# EAGLE design Adafruit 3.5in 480x320 FeatherWing (EAGLE 6.6.0)
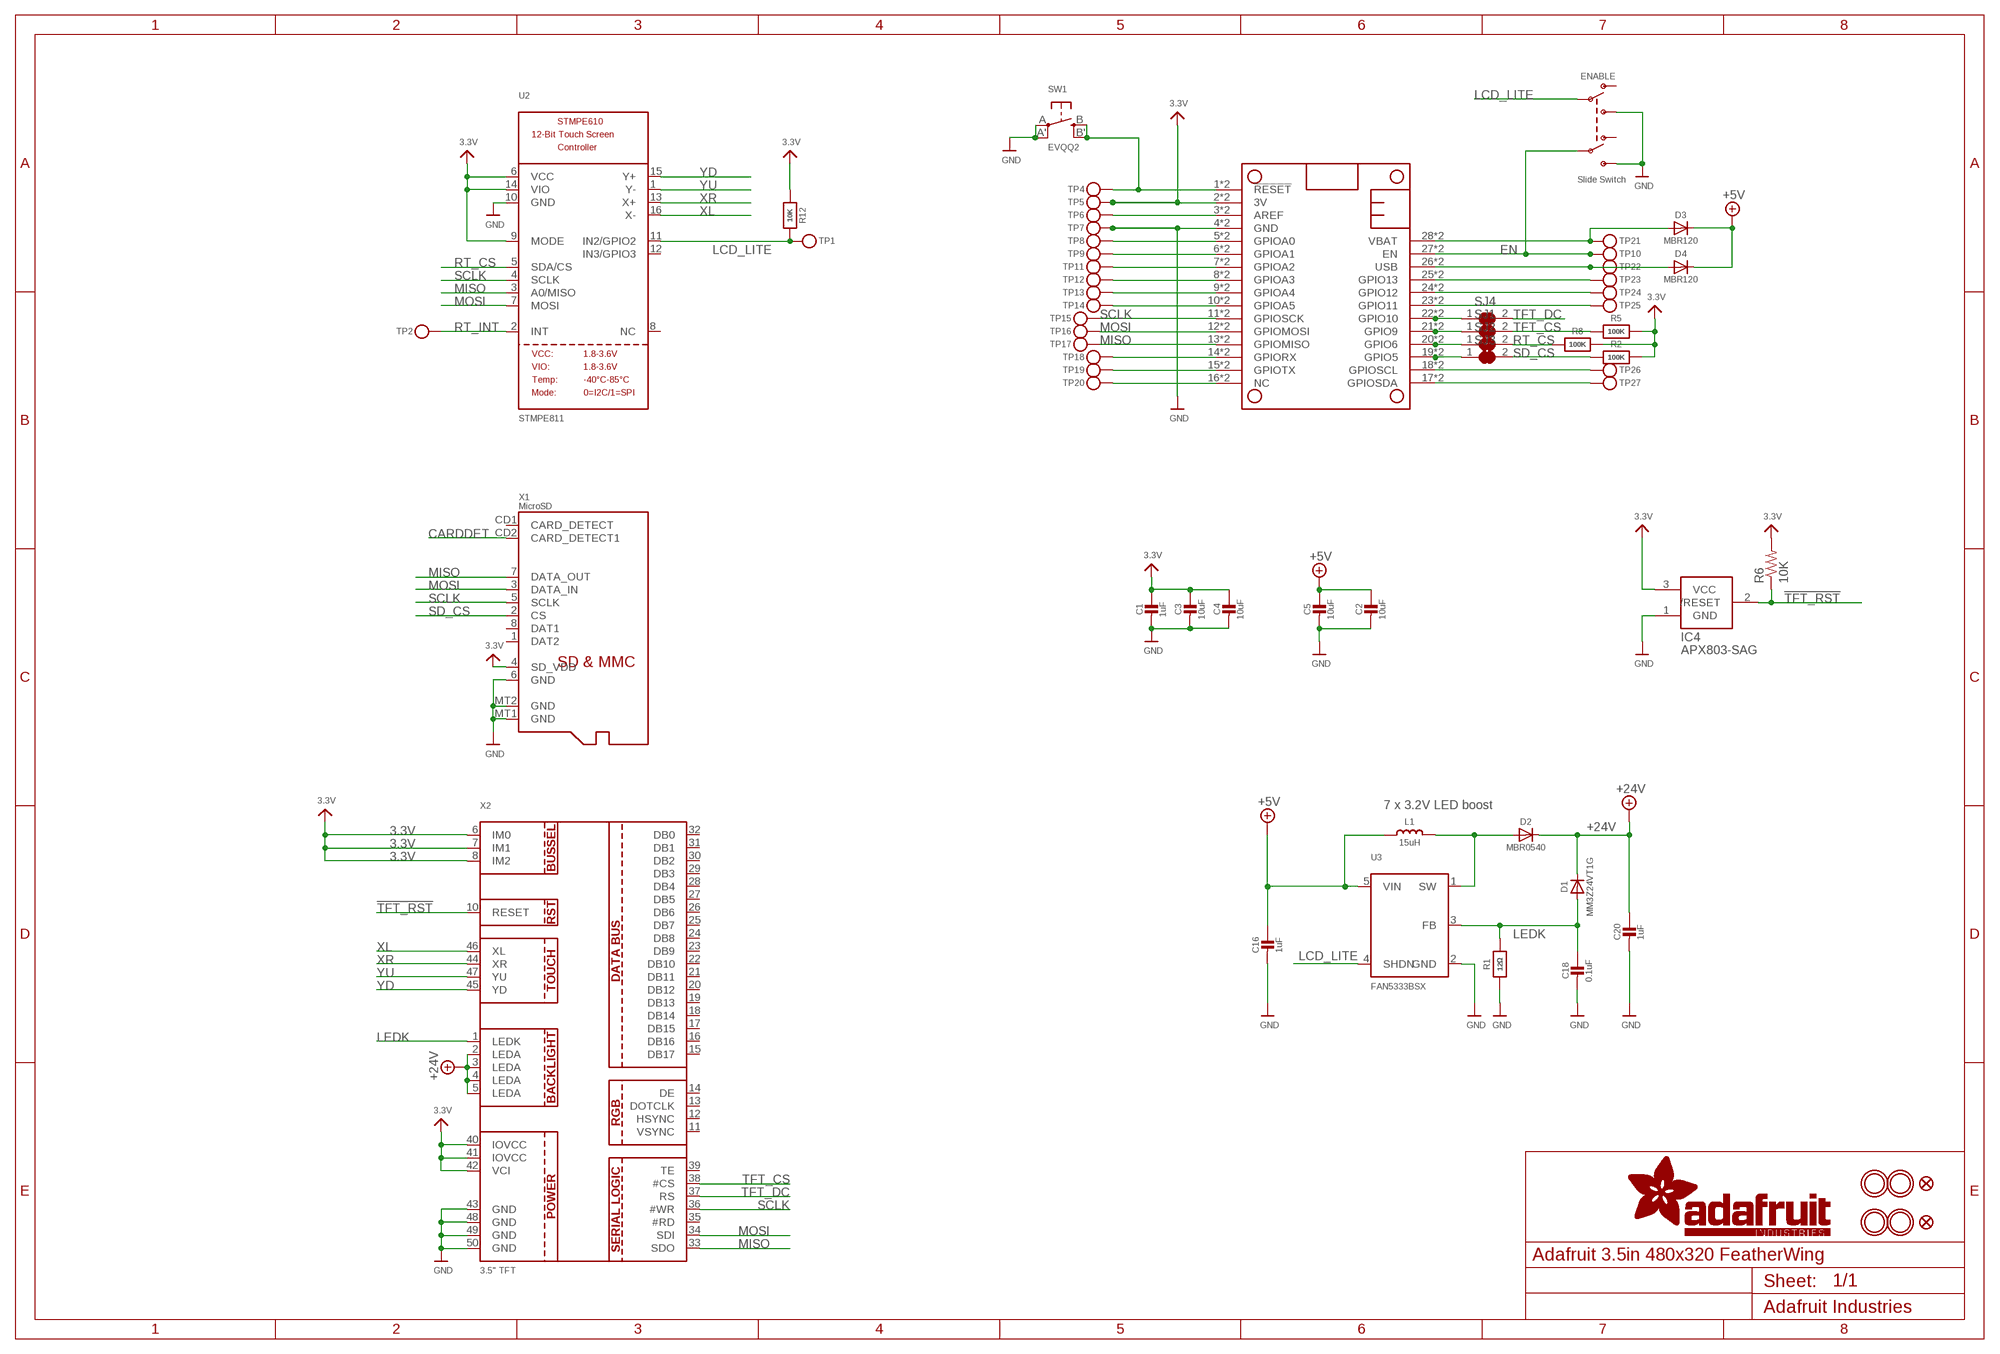
[diagram p0: schematic, sheet 1]

## Parts
C1  1uF  CAP_CERAMIC0805-NOOUTLINE  [0805-NO]
C2  10uF  CAP_CERAMIC0805-NOOUTLINE  [0805-NO]
C3  10uF  CAP_CERAMIC0805-NOOUTLINE  [0805-NO]
C4  10uF  CAP_CERAMIC0805-NOOUTLINE  [0805-NO]
C5  10uF  CAP_CERAMIC0805-NOOUTLINE  [0805-NO]
C16  1uF  CAP_CERAMIC0805-NOOUTLINE  [0805-NO]
C18  0.1uF  CAP_CERAMIC0805-NOOUTLINE  [0805-NO]
C20  1uF  CAP_CERAMIC0805-NOOUTLINE  [0805-NO]
D1  MM3Z24VT1G  DIODESMA  [SMADIODE]
D2  MBR0540  DIODESOD-123  [SOD-123]
D3  MBR120  DIODESOD-123  [SOD-123]
D4  MBR120  DIODESOD-123  [SOD-123]
ENABLE  Slide Switch  SWITCH_DPDTEG1390  [EG1390]
IC4  APX803-SAG  AXP083-SAG  [SOT23]
L1  15uH  INDUCTORNR5040  [INDUCTOR_5X5MM_NR5040_NOTHERMALS]
MS2  FEATHERWING_SMTDUAL  [FEATHERWING_SMT2]
R1  12Ω  RESISTOR0805_NOOUTLINE  [0805-NO]
R2  100K  RESISTOR0805_NOOUTLINE  [0805-NO]
R5  100K  RESISTOR0805_NOOUTLINE  [0805-NO]
R6  10K  R-US_R0805  [R0805]
R8  100K  RESISTOR0805_NOOUTLINE  [0805-NO]
R12  10K  RESISTOR0805_NOOUTLINE  [0805-NO]
SJ1  SOLDERJUMPER_CLOSED  [SOLDERJUMPER_CLOSEDWIRE]
SJ2  SOLDERJUMPER_CLOSED  [SOLDERJUMPER_CLOSEDWIRE]
SJ3  SOLDERJUMPER_CLOSED  [SOLDERJUMPER_CLOSEDWIRE]
SJ4  SOLDERJUMPER_CLOSED  [SOLDERJUMPER_CLOSEDWIRE]
SW1  EVQQ2  SWITCH_TACT_SMT_EVQQ2_SMALL  [EVQ-Q2_SMALLER]
TP1  TESTPOINTPAD2MM  [TESTPOINT_PAD_2MM]
TP2  TESTPOINTPAD2MM  [TESTPOINT_PAD_2MM]
TP4  TESTPOINTPAD2MM  [TESTPOINT_PAD_2MM]
TP5  TESTPOINTPAD2MM  [TESTPOINT_PAD_2MM]
TP6  TESTPOINTPAD2MM  [TESTPOINT_PAD_2MM]
TP7  TESTPOINTPAD2MM  [TESTPOINT_PAD_2MM]
TP8  TESTPOINTPAD2MM  [TESTPOINT_PAD_2MM]
TP9  TESTPOINTPAD2MM  [TESTPOINT_PAD_2MM]
TP10  TESTPOINTPAD2MM  [TESTPOINT_PAD_2MM]
TP11  TESTPOINTPAD2MM  [TESTPOINT_PAD_2MM]
TP12  TESTPOINTPAD2MM  [TESTPOINT_PAD_2MM]
TP13  TESTPOINTPAD2MM  [TESTPOINT_PAD_2MM]
TP14  TESTPOINTPAD2MM  [TESTPOINT_PAD_2MM]
TP15  TESTPOINTPAD2MM  [TESTPOINT_PAD_2MM]
TP16  TESTPOINTPAD2MM  [TESTPOINT_PAD_2MM]
TP17  TESTPOINTPAD2MM  [TESTPOINT_PAD_2MM]
TP18  TESTPOINTPAD2MM  [TESTPOINT_PAD_2MM]
TP19  TESTPOINTPAD2MM  [TESTPOINT_PAD_2MM]
TP20  TESTPOINTPAD2MM  [TESTPOINT_PAD_2MM]
TP21  TESTPOINTPAD2MM  [TESTPOINT_PAD_2MM]
TP22  TESTPOINTPAD2MM  [TESTPOINT_PAD_2MM]
TP23  TESTPOINTPAD2MM  [TESTPOINT_PAD_2MM]
TP24  TESTPOINTPAD2MM  [TESTPOINT_PAD_2MM]
TP25  TESTPOINTPAD2MM  [TESTPOINT_PAD_2MM]
TP26  TESTPOINTPAD2MM  [TESTPOINT_PAD_2MM]
TP27  TESTPOINTPAD2MM  [TESTPOINT_PAD_2MM]
U2  STMPE811  STMPE610  [QFN16_3MM]
U3  FAN5333BSX  FAN5331  [SOT23-5@1]
U$7  MOUNTINGHOLE3.0THIN  [MOUNTINGHOLE_3.0_PLATEDTHIN]
U$9  FIDUCIAL_1MM  [FIDUCIAL_1MM]
U$15  MOUNTINGHOLE3.0THIN  [MOUNTINGHOLE_3.0_PLATEDTHIN]
U$16  MOUNTINGHOLE3.0THIN  [MOUNTINGHOLE_3.0_PLATEDTHIN]
U$17  MOUNTINGHOLE3.0THIN  [MOUNTINGHOLE_3.0_PLATEDTHIN]
U$23  FIDUCIAL_1MM  [FIDUCIAL_1MM]
X1  MicroSD  MICROSD  [MICROSD]
X2  3.5" TFT  DISP_LCD_3.5IN_320X480_50PIN  [TFT_3.5IN_320X480_50PIN]

## Nets
3.3V: C1.1 C3.1 C4.1 IC4.3(VCC) MS2.2'(3V) MS2.2(3V) R2.2 R5.2 R6.2 R8.2 R12.1 TP5.P$1 U2.6(VCC) U2.9(MODE) U2.14(VIO) X1.4(SD_VDD) X2.6(IM0) X2.7(IM1) X2.8(IM2) X2.40(IOVCC) X2.41(IOVCC) X2.42(VCI)
!RESET: MS2.1'(!RESET) MS2.1(!RESET) SW1.B'(S1) SW1.B(S) TP4.P$1
!TFT_RST: IC4.2(/RESET) R6.1 X2.10(RESET)
+5V: C2.1 C5.1 C16.1 D3.C D4.C L1.P$1 U3.5(VIN)
+24V: C20.1 D1.C D2.C X2.2(LEDA) X2.3(LEDA) X2.4(LEDA) X2.5(LEDA)
A: MS2.5'(GPIOA0) MS2.5(GPIOA0) TP8.P$1
AREF: MS2.3'(AREF) MS2.3(AREF) TP6.P$1
B: MS2.6'(GPIOA1) MS2.6(GPIOA1) TP9.P$1
C: MS2.7'(GPIOA2) MS2.7(GPIOA2) TP11.P$1
CARDDET: X1.CD2(CARD_DETECT1)
D: MS2.8'(GPIOA3) MS2.8(GPIOA3) TP12.P$1
E: MS2.9'(GPIOA4) MS2.9(GPIOA4) TP13.P$1
EN: ENABLE.P2 MS2.27'(EN) MS2.27(EN) TP10.P$1
F: MS2.10'(GPIOA5) MS2.10(GPIOA5) TP14.P$1
G: MS2.16'(NC) MS2.16(NC) TP20.P$1
GND: C1.2 C2.2 C3.2 C4.2 C5.2 C16.2 C18.2 C20.2 ENABLE.S1 ENABLE.S2 IC4.1(GND) MS2.4'(GND) MS2.4(GND) R1.1 SW1.A'(P1) SW1.A(P) TP7.P$1 U2.10(GND) U3.2(GND) X1.6(GND) X1.MT1(GND) X1.MT2(GND) X2.43(GND) X2.48(GND) X2.49(GND) X2.50(GND)
H: MS2.19'(GPIO5) MS2.19(GPIO5) SJ3.1
I: MS2.20'(GPIO6) MS2.20(GPIO6) SJ2.1
J: MS2.21'(GPIO9) MS2.21(GPIO9) SJ1.1
K: MS2.22'(GPIO10) MS2.22(GPIO10) SJ4.1
L: MS2.23'(GPIO11) MS2.23(GPIO11) TP25.P$1
LCD_LITE: ENABLE.P1 R12.2 TP1.P$1 U2.11(IN2/GPIO2) U3.4(SHDN)
LEDK: C18.1 D1.A R1.2 U3.3(FB) X2.1(LEDK)
M: MS2.24'(GPIO12) MS2.24(GPIO12) TP24.P$1
MISO: MS2.13'(GPIOMISO) MS2.13(GPIOMISO) TP17.P$1 U2.3(A0/MISO) X1.7(DATA_OUT) X2.33(SDO)
MOSI: MS2.12'(GPIOMOSI) MS2.12(GPIOMOSI) TP16.P$1 U2.7(MOSI) X1.3(DATA_IN) X2.34(SDI)
N: MS2.25'(GPIO13) MS2.25(GPIO13) TP23.P$1
N$3: D2.A L1.P$2 U3.1(SW)
RT_CS: R8.1 SJ2.2 U2.5(SDA/CS)
RT_INT: TP2.P$1 U2.2(INT)
RX: MS2.14'(GPIORX) MS2.14(GPIORX) TP18.P$1
SCL: MS2.18'(GPIOSCL) MS2.18(GPIOSCL) TP26.P$1
SCLK: MS2.11'(GPIOSCK) MS2.11(GPIOSCK) TP15.P$1 U2.4(SCLK) X1.5(SCLK) X2.36(#WR)
SD_CS: R2.1 SJ3.2 X1.2(CS)
SDA: MS2.17'(GPIOSDA) MS2.17(GPIOSDA) TP27.P$1
TFT_CS: R5.1 SJ1.2 X2.38(#CS)
TFT_DC: SJ4.2 X2.37(RS)
TX: MS2.15'(GPIOTX) MS2.15(GPIOTX) TP19.P$1
USB: D4.A MS2.26'(USB) MS2.26(USB) TP22.P$1
VBAT: D3.A MS2.28'(VBAT) MS2.28(VBAT) TP21.P$1
XL: U2.16(X-) X2.46(XL)
XR: U2.13(X+) X2.44(XR)
YD: U2.15(Y+) X2.45(YD)
YU: U2.1(Y-) X2.47(YU)
Unconnected: ENABLE.O1 ENABLE.O2 U2.8(NC) U2.12(IN3/GPIO3) X1.1(DAT2) X1.8(DAT1) X1.CD1(CARD_DETECT) X2.11(VSYNC) X2.12(HSYNC) X2.13(DOTCLK) X2.14(DE) X2.15(DB17) X2.16(DB16) X2.17(DB15) X2.18(DB14) X2.19(DB13) X2.20(DB12) X2.21(DB11) X2.22(DB10) X2.23(DB9) X2.24(DB8) X2.25(DB7) X2.26(DB6) X2.27(DB5) X2.28(DB4) X2.29(DB3) X2.30(DB2) X2.31(DB1) X2.32(DB0) X2.35(#RD) X2.39(TE)

## Notes on the sheet
- 7 x 3.2V LED boost

## Library data of the parts
C1-C5 C16 C18 C20 = microbuilder:CAP_CERAMIC: Ceramic Capacitors For new designs, use the packages preceded by an '_' character since they are more reliable: The following footprints should be used on most boards: _0402 - Standard footprint for regular board layouts _0603 - Standard footprint for regular board layouts _0805 - Standard footprint for regular board layouts _1206 - Standard footprint for regular board layouts For extremely tight-pitch boards where space is at a premium, the following 'micro-pitch' footprints can be used (smaller pads, no silkscreen outline, etc.): _0402MP - Micro-pitch footprint for very dense/compact boards _0603MP - Micro-pitch footprint for very dense/compact boards _0805MP - Micro-pitch footprint for very dense/compact boards _1206MP - Micro-pitch footprint for very dense/compact boards
D1-D4 = microbuilder:DIODE: Diode SMA Model Volts Amps Type Vf Ir Digikey # Notes SSA34-E3 40V 3A Schottky 480mV @ 3A 200uA @ 40V SSA34-E3/61TGITR-ND CDBA120-G 20V 1A Schottky 500mV @ 1A 500uA @ 20V 641-1014-6-ND REEL MBRA210 10V 2A Schottky 350mV @ 2A 700uA @ 10V MBRA210LT3 SOD-123 Model Volts Amps Type Vf Ir Order # Notes BAT54T1G 30V 200mA Schottky 800mV @ 200mA 2uA @ 25V BAT54T1GOSTR-ND B0530W 30V 500mA Schottky 430mV @ 500mA 130uA @ 30V B0530W-FDICT-ND REEL MBR120 20V 1A Schottky 340mV @ 1A MBR120VLSFT1GOSCT-ND SOD-323 Model Volts Amps Type Vf Ir Order # Notes PMEG2005EJ 20V 500mA Schottky 355mV @ 500mA 568-4110-1-ND ZLLS410 10V 570mA Schottky 380mV @ 570mA ZLLS410CT-ND 1N4148WS 75V 150mA Silicon/Simple 1V 1N4148WSFSCT-ND REEL SOD-523 Model Volts Amps Type Vf Ir Order # Notes BAT54XV2 30V 200mA Schottky 0.8V @ 100mA BAT54XV2CT-ND TB751S 30V 30mA Schottky RB751S-40TE61CT-ND SOT23-R/W (R = Solder Paste/Reflow Ovens, W = Hand-Soldering) Model Volts Amps Type Vf Ir Order # Notes BAT54FILM 40V 300mA Schottky 497-7162-1-ND POWERDI-5 Model Volts Amps Type Vf Ir Order # Notes PDS560 60V 5A Schottky 670mV @ 5A 150uA @ 60V PDS560DICT-ND
ENABLE = microbuilder:SWITCH_DPDT: Switch - DPDT A DPDT Switch acts like an SPDT switch, but has a pair of switches instead of just one. Vertical - 0.3A @ 6V SMT - Digikey: JS202011SCQN
IC4 = adafruit:AXP083
L1 = microbuilder:INDUCTOR: Inductors 0603: 10nH Ceramic Inductor - microwire antenna/RF (Digikey: 712-1434-2-ND) 0805: 560nH Ceramic Inductor - RF (Digikey: 553-1047-1-ND) 270nH Ceramic Inductor - Q = 40@250MHz, +-5%, 1 Ohm DC Resistance (Digikey: 535-10506-2-ND) 1007 (2518 Metric) SMT: 10µH 10% 250mOhm 820mA 1007 Inductor (Digikey: 587-2189-1-ND) 22µH 10% 500mOhm 580mA 1007 Inductor (Digikey: 587-2190-1-ND) 47µH 10% 950mOhm 420mA 1007 Inductor (Digikey: 587-2191-1-ND) 47µH 5% 100mOhm 1A 1008 Inductor (Digikey: 732-1816-1-ND) 5.0x5.0mm (Taiyo Yuden NR5040 Series) 6.8µH 20% 2.3A 64mOhm Inductor (Digikey: 587-2374-2-ND) 5.0x5.0mm (TDK VLC5045 Series) 4.7µH 20% 3.3A 34mOhm Inductor (Digikey: 445-6526-1-ND) 6.8µH 20% 2.7A 46mOhm Inductor (Digikey: 445-6527-1-ND) 6.0x6.0mm (TDK VLC6045 Series) 4.7µH 20% 3.8A 27mOhm Inductor (Digikey: 445-6538-2-ND) 6.8µH 20% 3A 41mOhm Inductor (Digikey: 445-6540-1-ND) 6.2µH 30% 2.2A 45mOhm Inductor (Digikey: SRR5028-6R2YCT-ND) - Not TDK VLC6045 but footprint should match 6.0x6.0mm (TDK SLF6045 Series) 6.8uH 30% 2A 33mOhm Inductor (Digikey: 445-4572-1-ND, Mouser: 810-SLF645T6R8N2R0PF) 6.0x6.0mm (Sumida CDRH5D28 Series) 6.2uH 30% 1.8A 45mOhm Inductor (Digikey: 308-1542-1-ND) Taiyo Yuden NR3015T2R2M - 2.2uH 20% 1.5A (Digikey: 587-1648-2-ND, Mouser: 963-NR3015T2R2M) - Used with TI TPS62172 CoilCraft RFID Transponder Coil - MA5532-AE (For use with AS3935 Lightning Sensor) Taiyo Yuden NRH2412T2R2MNGH - 2.2uH 20% 1AA (Digikey: 587-3443-1-ND) - Used with TI LM3671 Vishay IHLP 1.0uH Molded Inductor - 24mOhm DCR, 5A, +/-20%, -55°C-125°C (Digikey: 541-1319-1-ND)
MS2 = microbuilder:FEATHERWING
R1 R2 R5 R8 R12 = microbuilder:RESISTOR: Resistors For new designs, use the packages preceded by an '_' character since they are more reliable: The following footprints should be used on most boards: _0402 - Standard footprint for regular board layouts _0603 - Standard footprint for regular board layouts _0805 - Standard footprint for regular board layouts _1206 - Standard footprint for regular board layouts For extremely tight-pitch boards where space is at a premium, the following 'micro-pitch' footprints can be used (smaller pads, no silkscreen outline, etc.): _0402MP - Micro-pitch footprint for very dense/compact boards _0603MP - Micro-pitch footprint for very dense/compact boards _0805MP - Micro-pitch footprint for very dense/compact boards _1206MP - Micro-pitch footprint for very dense/compact boards
R6 = rcl:R-US_: RESISTOR, American symbol
SJ1-SJ4 = microbuilder:SOLDERJUMPER_CLOSED: Solder Jumper - Closed These solder jumpers are closed by default CLOSEDWIRE - 10 mil trace between pads that can be cut and resoldered later CLOSEDPERM - 63 mil trace between pads for a permanent connection (used to 'bridge' two signals, a shameless hack for Eagle). Can double as a test point as well (no cream layer)
SW1 = microbuilder:SWITCH_TACT_SMT: SMT Tact Switches 6x6mm - Digikey: P12940SCT-ND KMR2 (4.6x2.8mm) - Digikey: 401-1426-1-ND EVQ-PQHB55 - Light Touch, 160GF (4.5x4.5mm) - Digikey: P8090SCT-ND KMT0 - KMT021 NGJ LHS (etc.) IP68/Waterproof - Digikey: CKN10289CT-ND
TP1 TP2 TP4-TP27 = microbuilder:TESTPOINT: Test Point Various test points for characterisation and PCB testing TESTPOINT_SMT - Compact Surface Mount Test Point [Digikey: 5016KTR-ND]
U2 = microbuilder:STMPE610: STMPE610 - 12-Bit Touch Screen Controller
U3 = microbuilder:FAN5331: FAN5331 - LED/OLED 20V Boost Converter Digikey: FAN5331SXCT-ND
U$7 U$15-U$17 = microbuilder:MOUNTINGHOLE: Mounting Hole For #2 screws (0.086"/2.18mm width, 0.094"/2.4mm hole) use 2.5mm; BOM: EXCLUDE
U$9 U$23 = microbuilder:FIDUCIAL: Fiducial Alignment Points Various fiducial points for machine vision alignment.; BOM: EXCLUDE
X1 = microbuilder:MICROSD: MicroSD/Transflash Card Holder with SPI pinout 3M: 2908-05WB-MG 4UConnector: 19656 Footprint courtesy: Adafruit Industries
X2 = microbuilder:DISP_LCD_3.5IN_320X480_50PIN: DT350HV15-T - 3.5" 320x480 TFT Display, 50 Pin Connector

## Board
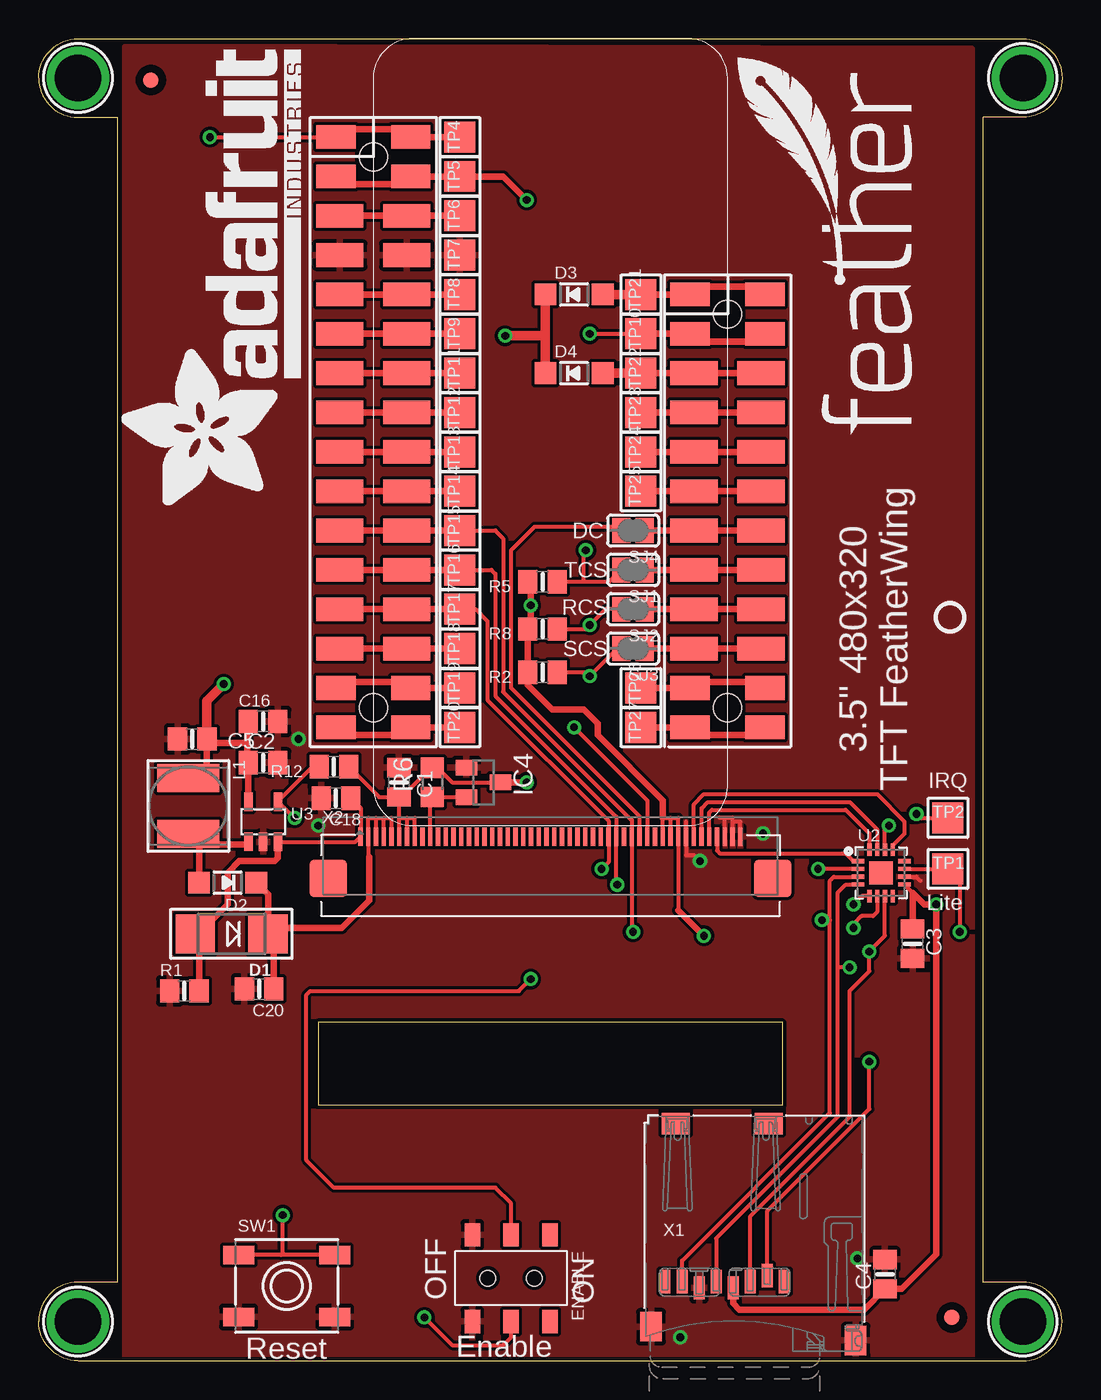
[diagram p1: board, top side]
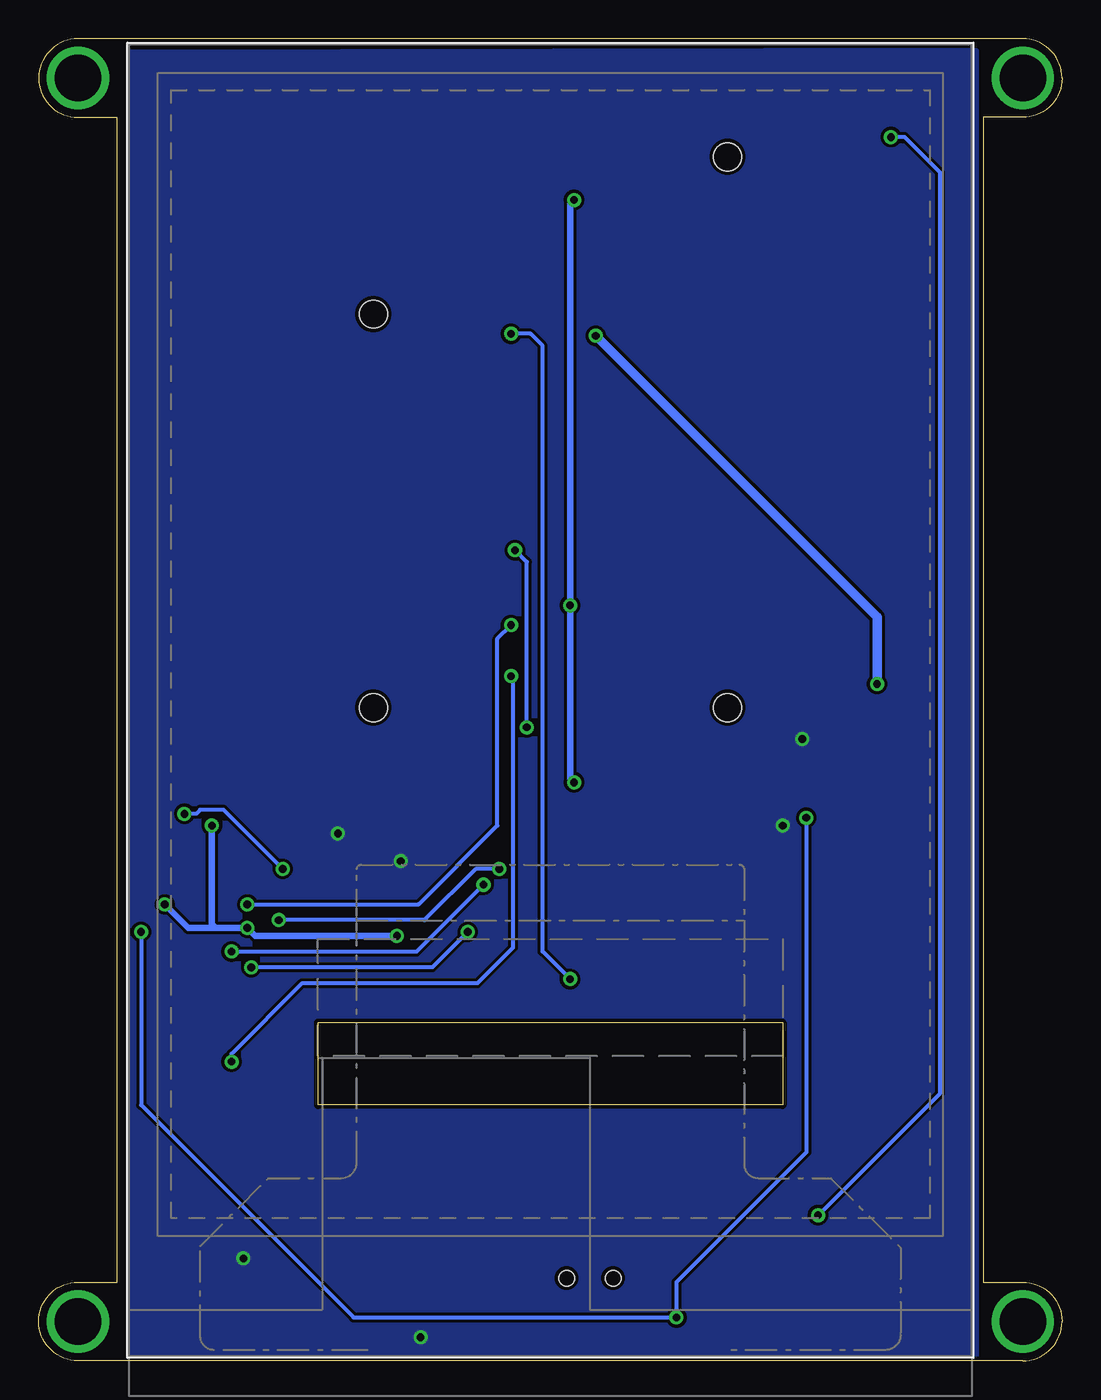
[diagram p2: board, bottom side, seen from below]

Size 66.04 x 85.34 mm. Coordinates in mm from the lower left corner, seen from the top.
Outline: 2.54,0 63.5,0 arc90 66.04,2.54 arc90 63.5,5.08 60.96,5.08 60.96,80.26 63.5,80.26 arc90 66.04,82.8 arc90 63.5,85.34 2.54,85.34 arc90 0,82.8 arc90 2.54,80.26 5.08,80.26 5.08,5.08 2.54,5.08 arc90 0,2.54 arc90 2.54,0
Outline: 18.03,21.84 18.03,16.51 48.01,16.51 48.01,21.84 18.03,21.84
Copper layers (1*16): Top 0.035mm / dielectric 1.5mm / Bottom 0.035mm
Design rules "adafruit *": minimum track width 8mil, minimum drill 15.5mil, track to track 8mil, track to pad 8mil, pad to pad 8mil, via to via 8mil, smd to smd 8mil, copper to edge 10mil, drill to drill 8mil, minimum pad ring 10mil, minimum via ring 8mil, stop-mask expansion 2mil, vias tented up to drill 20mil, thermal gap 10mil
tRestrict: area 44.5,33.7 to 44.6,34; area 45,33.7 to 45.1,34

### Footprints (pad centres in the part's own frame; a part is rotated, then mirrored left to right if it is on the bottom)
0805-NO = smd 1.24 x 1.5: 1 -0.95,0; 2 0.95,0
SMADIODE = smd 2.54 x 2.54: A 2.349,0; C -2.349,0
SOD-123 = smd 1.4 x 1.4: A 1.85,0; C -1.85,0
EG1390 = smd 1 x 1.5: O1 -2.5,2.8; O2 -2.5,-2.8; P1 0,2.8; P2 0,-2.8; S1 2.5,2.8; S2 2.5,-2.8 | hole 1: 1.5,0; -1.5,0
SOT23 = smd 1 x 1.4: 1 -0.95,-1.1; 2 0.95,-1.1; 3 0,1.1
INDUCTOR_5X5MM_NR5040_NOTHERMALS = smd 1.8 x 4: P$1 -1.8,0; P$2 1.8,0
FEATHERWING_SMT2 = smd 1.524 x 2.54: 1 6.35,2.413; 1' 6.35,-2.413; 2 8.89,2.413; 2' 8.89,-2.413; 15 41.91,2.413; 15' 41.91,-2.413; 16 44.45,2.413; 16' 44.45,-2.413; 17 44.45,20.447; 17' 44.45,25.273; 18 41.91,20.447; 18' 41.91,25.273; 27 19.05,20.447; 27' 19.05,25.273; 28 16.51,20.447; 28' 16.51,25.273 | smd 1.524 x 3.048: 3 11.43,2.159; 3' 11.43,-2.159; 4 13.97,2.159; 4' 13.97,-2.159; 5 16.51,2.159; 5' 16.51,-2.159; 6 19.05,2.159; 6' 19.05,-2.159; 7 21.59,2.159; 7' 21.59,-2.159; 8 24.13,2.159; 8' 24.13,-2.159; 9 26.67,2.159; 9' 26.67,-2.159; 10 29.21,2.159; 10' 29.21,-2.159; 11 31.75,2.159; 11' 31.75,-2.159; 12 34.29,2.159; 12' 34.29,-2.159; 13 36.83,2.159; 13' 36.83,-2.159; 14 39.37,2.159; 14' 39.37,-2.159; 19 39.37,20.701; 19' 39.37,25.019; 20 36.83,20.701; 20' 36.83,25.019; 21 34.29,20.701; 21' 34.29,25.019; 22 31.75,20.701; 22' 31.75,25.019; 23 29.21,20.701; 23' 29.21,25.019; 24 26.67,20.701; 24' 26.67,25.019; 25 24.13,20.701; 25' 24.13,25.019; 26 21.59,20.701; 26' 21.59,25.019 | hole 1.8: 17.78,22.86; 43.18,22.86; 7.62,0; 43.18,0
R0805 = smd 1.3 x 1.5: 1 -0.95,0; 2 0.95,0
SOLDERJUMPER_CLOSEDWIRE = smd 1.168 x 1.6: 1 -0.762,0; 2 0.762,0 | smd 0.635 x 0.203: WIRE 0,0
EVQ-Q2_SMALLER = smd 2 x 1.2: A -3.1,-2; A' 3.1,-2; B -3.1,2; B' 3.1,2
TESTPOINT_PAD_2MM = smd 2 x 2: P$1 0,0
QFN16_3MM = smd 0.8 x 0.28: 1 -1.5,0.75; 2 -1.5,0.25; 3 -1.5,-0.25; 4 -1.5,-0.75; 9 1.5,-0.75; 10 1.5,-0.25; 11 1.5,0.25; 12 1.5,0.75 | smd 0.28 x 0.8: 5 -0.75,-1.5; 6 -0.25,-1.5; 7 0.25,-1.5; 8 0.75,-1.5; 13 0.75,1.5; 14 0.25,1.5; 15 -0.25,1.5; 16 -0.75,1.5 | smd 1.5 x 1.5: THERMAL 0,0
SOT23-5@1 = smd 0.55 x 1.2: 1 -0.95,-1.3; 2 0,-1.3; 3 0.95,-1.3; 4 0.95,1.3; 5 -0.95,1.3
MOUNTINGHOLE_3.0_PLATEDTHIN = drill 3 pad 3.6: P$1 0,0
FIDUCIAL_1MM = smd 1 x 1: 1 0,0
MICROSD = smd 0.7 x 1.5: 1 9,-10.64; 2 7.9,-10.24; 3 6.8,-10.64; 4 5.7,-11.04; 5 4.6,-10.64; 6 3.5,-11.04; 7 2.4,-10.64; 8 1.3,-10.64 | smd 1.8 x 1.4: CD1 2,-0.44; CD2 8,-0.44 | smd 1.4 x 1.9: MT1 0.4,-13.54; MT2 13.6,-14.44
TFT_3.5IN_320X480_50PIN = smd 0.275 x 1.2 bottom: 1 12.25,-3.76; 2 11.75,-3.76; 3 11.25,-3.76; 4 10.75,-3.76; 5 10.25,-3.76; 6 9.75,-3.76; 7 9.25,-3.76; 8 8.75,-3.76; 9 8.25,-3.76; 10 7.75,-3.76; 11 7.25,-3.76; 12 6.75,-3.76; 13 6.25,-3.76; 14 5.75,-3.76; 15 5.25,-3.76; 16 4.75,-3.76; 17 4.25,-3.76; 18 3.75,-3.76; 19 3.25,-3.76; 20 2.75,-3.76; 21 2.25,-3.76; 22 1.75,-3.76; 23 1.25,-3.76; 24 0.75,-3.76; 25 0.25,-3.76; 26 -0.25,-3.76; 27 -0.75,-3.76; 28 -1.25,-3.76; 29 -1.75,-3.76; 30 -2.25,-3.76; 31 -2.75,-3.76; 32 -3.25,-3.76; 33 -3.75,-3.76; 34 -4.25,-3.76; 35 -4.75,-3.76; 36 -5.25,-3.76; 37 -5.75,-3.76; 38 -6.25,-3.76; 39 -6.75,-3.76; 40 -7.25,-3.76; 41 -7.75,-3.76; 42 -8.25,-3.76; 43 -8.75,-3.76; 44 -9.25,-3.76; 45 -9.75,-3.76; 46 -10.25,-3.76; 47 -10.75,-3.76; 48 -11.25,-3.76; 49 -11.75,-3.76; 50 -12.25,-3.76 | smd 2.4 x 2.4 bottom: PAD1 14.35,-6.46; PAD2 -14.35,-6.46

### Placement (x,y rotation side)
C1  23.24,37.34 90 top
C2  14.48,38.61 0 top
C3  56.39,26.92 270 top
C4  54.61,5.59 90 top
C5  9.91,40.13 180 top
C16  14.48,41.27 0 top
C18  19.18,36.32 180 top
C20  14.22,24 180 top
D1  12.45,27.56 180 top
D2  12.19,30.86 180 top
D3  34.54,68.83 0 top
D4  34.54,63.75 0 top
ENABLE  30.48,5.33 180 top
IC4  28.7,37.34 270 top
L1  9.65,35.81 270 top
MS2  21.59,85.34 270 top
R1  9.4,23.88 0 top
R2  32.51,44.45 180 top
R5  32.51,50.29 180 top
R6  25.4,37.34 90 top
R8  32.51,47.24 180 top
R12  19.05,38.35 180 top
SJ1  38.35,51.05 180 top
SJ2  38.35,48.51 180 top
SJ3  38.35,45.97 180 top
SJ4  38.35,53.59 180 top
SW1  16,4.83 0 top
TP1  58.67,31.75 0 top
TP2  58.67,35.05 0 top
TP4  27.18,78.99 90 top
TP5  27.18,76.45 90 top
TP6  27.18,73.91 90 top
TP7  27.18,71.37 90 top
TP8  27.18,68.83 90 top
TP9  27.18,66.29 90 top
TP10  38.86,66.29 90 top
TP11  27.18,63.75 90 top
TP12  27.18,61.21 90 top
TP13  27.18,58.67 90 top
TP14  27.18,56.13 90 top
TP15  27.18,53.59 90 top
TP16  27.18,51.05 90 top
TP17  27.18,48.51 90 top
TP18  27.18,45.97 90 top
TP19  27.18,43.43 90 top
TP20  27.18,40.89 90 top
TP21  38.86,68.83 90 top
TP22  38.86,63.75 90 top
TP23  38.86,61.21 90 top
TP24  38.86,58.67 90 top
TP25  38.86,56.13 90 top
TP26  38.86,43.43 90 top
TP27  38.86,40.89 90 top
U2  54.36,31.5 0 top
U3  14.48,34.8 0 top
U$7  2.54,2.54 0 top
U$9  58.93,2.79 0 top
U$11  [FEATHERLOGO]  56.39,59.82 90 top
U$15  63.5,2.54 0 top
U$16  2.54,82.8 0 top
U$17  63.5,82.8 0 top
U$19  [ADAFRUIT_TEXT_30MM]  16.89,54.99 90 top
U$23  7.24,82.68 0 top
U$37  [PCBFEAT-REV-040]  58.8,48.01 90 top
X1  39.12,15.75 0 top
X2  33.02,37.59 0 bottom

### Tracks (layer width: path | path; a pad name or v marks a point on that pad's centre or on a via)
3.3V  (via drill 0.5)
  Top 0.254: X2.6 23.27,35.05 | 23.27,35.05 23.77,35.05 | 23.77,35.05 24.27,35.05 X2.8 | X2.7 23.77,35.05 | 23.27,35.05 23.27,36.39 C1.1 | C1.1 23.43,36.39 24.89,37.85 24.96,37.85 R6.2 25.72,38.29 26.67,37.34 IC4.3 | U2.9 56.39,30.21 | U2.6 54.11,28.96 53.85,28.7 53.09,28.7 52.58,28.19 v52.58,27.94 | X2.40 40.27,35.05 40.77,35.05 | 40.77,35.05 41.27,35.05 X2.42 41.27,29.09 | X2.41 40.77,35.05 | R12.1 21.97,36.39 C1.1 | U2.14 54.61,34.29 v54.86,34.54
  Top 0.406: IC4.3 v31.5,37.34 | X1.4 44.82,3.7 45.21,3.3 53.27,3.3 C4.1 55.69,4.64 57.91,6.86 v57.91,29.46 57.14,29.46 56.39,30.21 C3.1 | v31.5,74.93 29.97,76.45 TP5.P$1 MS2.2 23.88,76.45 23.37,75.95 19.69,75.95 MS2.2' | 41.27,29.09 v42.93,27.43 | 40.27,35.05 40.27,36.18 36.07,40.39 36.07,41.15 35.18,42.04 33.15,42.04 31.56,43.62 R2.2 R8.2 31.75,47.43 v31.75,48.77 31.75,50.1 R5.2
  Bottom 0.254: v31.5,37.34 31.75,37.59 | 31.75,48.01 v31.75,48.77
  Bottom 0.406: 54.61,27.94 v52.58,27.94 52.07,27.43 v42.93,27.43 | 54.61,27.94 56.39,27.94 v57.91,29.46 | 31.75,37.59 31.75,48.01 31.75,74.68 v31.5,74.93 | v54.86,34.54 54.86,28.19 54.61,27.94
!RESET  (via drill 0.5)
  Top 0.254: SW1.B' 15.62,6.83 | 15.62,6.83 SW1.B | 15.62,6.83 15.75,6.96 v15.75,9.4 | v11.05,78.99 MS2.1'
  Top 0.406: TP4.P$1 MS2.1 23.75,78.99 23.24,79.5 19.69,79.5 MS2.1'
  Bottom 0.254: v15.75,9.4 7.87,17.27 7.87,76.71 10.16,78.99 v11.05,78.99
!TFT_RST
  Top 0.254: X2.10 25.27,36.26 R6.1 IC4.2
+5V  (via drill 0.5)
  Top 0.406: 13.46,39.88 13.46,38.61 C2.1 U3.5 | L1.P$1 10.86,37.61 C5.1 10.86,39.88 13.46,39.88 | 13.46,39.88 13.46,41.21 C16.1
  Top 0.61: D4.C 32.69,66.17 | 32.69,66.17 D3.C | 32.69,66.17 v30.1,66.17 | v11.94,43.69 10.86,42.61 C5.1
  Bottom 0.61: v30.1,66.17 11.94,48.01 v11.94,43.69
+24V
  Top 0.254: 21.77,35.05 21.27,35.05 X2.2 21.27,32.58 21.34,32.51 | 21.77,35.05 22.27,35.05 | 22.27,35.05 22.77,35.05 X2.5 | X2.4 22.27,35.05 | X2.3 21.77,35.05
  Top 0.406: D2.C 14.8,30.11 D1.C | D1.C 15.17,27.18 C20.1 | 21.34,32.51 21.34,29.72 19.56,27.94 15.18,27.94 D1.C
A
  Top 0.406: TP8.P$1 MS2.5 MS2.5'
AREF
  Top 0.406: MS2.3' MS2.3 TP6.P$1
B
  Top 0.406: MS2.6' MS2.6 TP9.P$1
C
  Top 0.406: TP11.P$1 MS2.7 MS2.7'
D
  Top 0.406: MS2.8' MS2.8 TP12.P$1
E
  Top 0.406: TP13.P$1 MS2.9 MS2.9'
EN  (via drill 0.5)
  Top 0.254: ENABLE.P2 30.48,10.16 29.46,11.18 19.05,11.18 17.27,12.95 17.27,23.62 17.53,23.88 30.99,23.88 v31.75,24.64 | v35.56,66.29 TP10.P$1
  Top 0.406: TP10.P$1 MS2.27 42.55,65.79 46.48,65.79 46.86,66.17 MS2.27'
  Bottom 0.254: v31.75,24.64 33.53,26.42 33.53,65.53 34.29,66.29 v35.56,66.29
F
  Top 0.406: TP14.P$1 MS2.10 MS2.10'
G
  Top 0.406: TP20.P$1 MS2.16 23.75,40.89 23.24,40.39 19.69,40.39 MS2.16'
GND  (via drill 0.5)
  Top 0.254: X2.48 44.27,35.05 | 44.27,35.05 43.94,35.05 | X2.49 44.77,34.8 | 44.77,34.8 44.77,35.05 44.27,35.05 | 41.77,34.8 X2.43 41.77,32.65 42.28,32.65 v42.67,32.26 | X2.50 45.27,34.8 44.77,34.8 | U2.10 56.64,31.25 56.9,30.99
  other vias: 46.74,34.04 18.03,34.54 16.76,40.13 41.4,1.52 52.83,6.6
  pour Top: 5.59,84.84 5.59,0 60.2,-0.13 60.2,84.71
  pour Bottom: 5.59,84.58 5.59,-0.25 60.2,-0.38 60.2,84.45
H
  Top 0.406: SJ3.1 MS2.19 MS2.19'
I
  Top 0.406: MS2.20' MS2.20 SJ2.1
J
  Top 0.406: SJ1.1 MS2.21 MS2.21'
K
  Top 0.406: MS2.22' MS2.22 SJ4.1
L
  Top 0.406: TP25.P$1 41.4,56.13 41.4,56.39 42.29,56.39 MS2.23 MS2.23'
LCD_LITE  (via drill 0.5)
  Top 0.254: U2.11 TP1.P$1 59.44,30.99 v59.44,27.69 | v16.51,35.05 16.47,35.05 U3.4 17.68,38.35 R12.2 | v24.89,2.79 26.67,1.02 29.97,1.02 30.48,1.52 ENABLE.P1
  Bottom 0.254: v16.51,35.05 16.51,13.46 24.89,5.08 v24.89,2.79 45.72,2.79 59.44,16.51 v59.44,27.69
LEDK
  Top 0.254: C18.1 20.77,35.68 X2.1 20.44,33.5 U3.3
  Top 0.406: D1.A 10.29,27.56 | 10.29,27.56 12.19,29.46 12.19,31.5 12.95,32.26 15.24,32.26 15.43,32.45 U3.3 | 10.29,27.56 10.35,27.5 R1.2
M
  Top 0.406: MS2.24' MS2.24 TP24.P$1
MISO  (via drill 0.5)
  Top 0.254: TP17.P$1 28.19,48.51 28.96,47.75 28.96,42.67 36.77,34.86 X2.33 36.77,32.2 v36.32,31.75 | X1.7 41.52,6.46 51.05,16 51.05,28.45 | 51.05,28.45 51.05,30.99 51.31,31.24 U2.3 | v50.55,28.45 51.05,28.45
  Top 0.406: TP17.P$1 MS2.13 MS2.13'
  Bottom 0.254: v36.32,31.75 37.85,31.75 41.15,28.45 v50.55,28.45
MOSI  (via drill 0.5)
  Top 0.254: TP16.P$1 29.21,51.05 29.46,50.8 29.46,42.93 37.27,35.12 X2.34 37.27,30.8 v37.34,30.73 | X1.3 45.92,9.34 52.32,15.75 52.32,23.88 53.59,25.15 v53.59,26.42 54.61,27.43 U2.7
  Top 0.406: TP16.P$1 MS2.12 MS2.12'
  Bottom 0.254: v53.59,26.42 41.66,26.42 v37.34,30.73
N
  Top 0.406: TP23.P$1 MS2.25 MS2.25'
N$3
  Top 0.406: L1.P$2 10.34,33.32 | 10.34,33.32 D2.A | U3.1 13.35,33.32 10.34,33.32
RT_CS  (via drill 0.5)
  Top 0.254: SJ2.2 36.58,48.51 v35.56,47.5 35.31,47.24 R8.1 | U2.5 53.11,30 v52.58,29.46
  Bottom 0.254: v52.58,29.46 41.53,29.46 36.45,34.54 36.45,46.61 v35.56,47.5
RT_INT  (via drill 0.5)
  Top 0.254: U2.2 v50.29,31.75 | v56.64,35.31 56.9,35.05 TP2.P$1
  Bottom 0.254: v50.29,31.75 53.85,35.31 54.1,35.56 55.63,35.56 55.88,35.31 56.39,35.31 v56.64,35.31
RX
  Top 0.406: TP18.P$1 MS2.14 MS2.14'
SCL
  Top 0.406: TP26.P$1 MS2.18 42.42,43.81 46.48,43.81 MS2.18'
SCLK  (via drill 0.5)
  Top 0.254: TP15.P$1 29.46,53.59 29.97,53.09 29.97,43.18 38.27,34.88 X2.36 38.27,27.77 v38.35,27.69 | X1.5 43.72,7.9 51.56,15.75 51.56,25.4 | 51.56,25.4 51.56,30.23 52.08,30.75 U2.4 | v52.32,25.4 51.56,25.4
  Top 0.406: TP15.P$1 MS2.11 MS2.11'
  Bottom 0.254: v38.35,27.69 40.64,25.4 v52.32,25.4
SD_CS  (via drill 0.5)
  Top 0.254: X1.2 47.02,9.68 53.59,16.26 v53.59,19.3 | R2.1 35.31,44.45 v35.56,44.2 37.34,45.97 SJ3.2
  Bottom 0.254: v53.59,19.3 53.59,19.81 49.02,24.38 37.72,24.38 35.43,26.67 35.43,44.07 v35.56,44.2
SDA
  Top 0.406: TP27.P$1 MS2.17 42.55,40.39 46.48,40.39 46.86,40.77 MS2.17'
TFT_CS  (via drill 0.5)
  Top 0.254: v34.54,40.89 39.27,36.17 X2.38 | R5.1 35.18,50.29 | 35.18,50.29 36.83,50.29 SJ1.2 | 35.18,50.29 35.18,52.2 v35.31,52.32
  Bottom 0.254: v34.54,40.89 34.54,51.56 v35.31,52.32
TFT_DC
  Top 0.254: X2.37 38.77,35.14 30.48,43.43 30.48,52.32 32,53.85 37.34,53.85 SJ4.2
TX
  Top 0.406: TP19.P$1 MS2.15 23.75,43.43 23.37,43.81 19.56,43.81 MS2.15'
USB
  Top 0.406: MS2.26' MS2.26 TP22.P$1
  Top 0.61: TP22.P$1 D4.A
VBAT
  Top 0.406: TP21.P$1 MS2.28 42.55,69.34 46.23,69.34 46.74,68.83 MS2.28'
  Top 0.61: D3.A TP21.P$1
XL
  Top 0.254: X2.46 43.27,35.4 43.43,35.56 52.07,35.56 53.59,34.04 53.59,33.01 U2.16
XR
  Top 0.254: X2.44 42.27,35.92 42.93,36.58 54.1,36.58 55.88,34.8 55.88,34.04 55.12,33.27 55.12,33.01 U2.13
YD
  Top 0.254: X2.45 42.77,35.66 43.18,36.07 52.32,36.07 54.1,34.29 U2.15
YU
  Top 0.254: X2.47 43.77,32.94 43.94,32.77 52.07,32.77 52.59,32.25 U2.1

### Text on the board
tPlace: DC | TCS | RCS | 3.5" 480x320 / TFT FeatherWing | SCS | IRQ | Lite | OFF | ON | Reset | Enable